# Altium schematic sheet SMPS_sync_rect.SchDoc
size A3; Organization: Altium Limited; Address1: L3, 12a Rodborough Rd; Address2: Frenchs Forest; Address3: NSW; Address4: Australia 2086
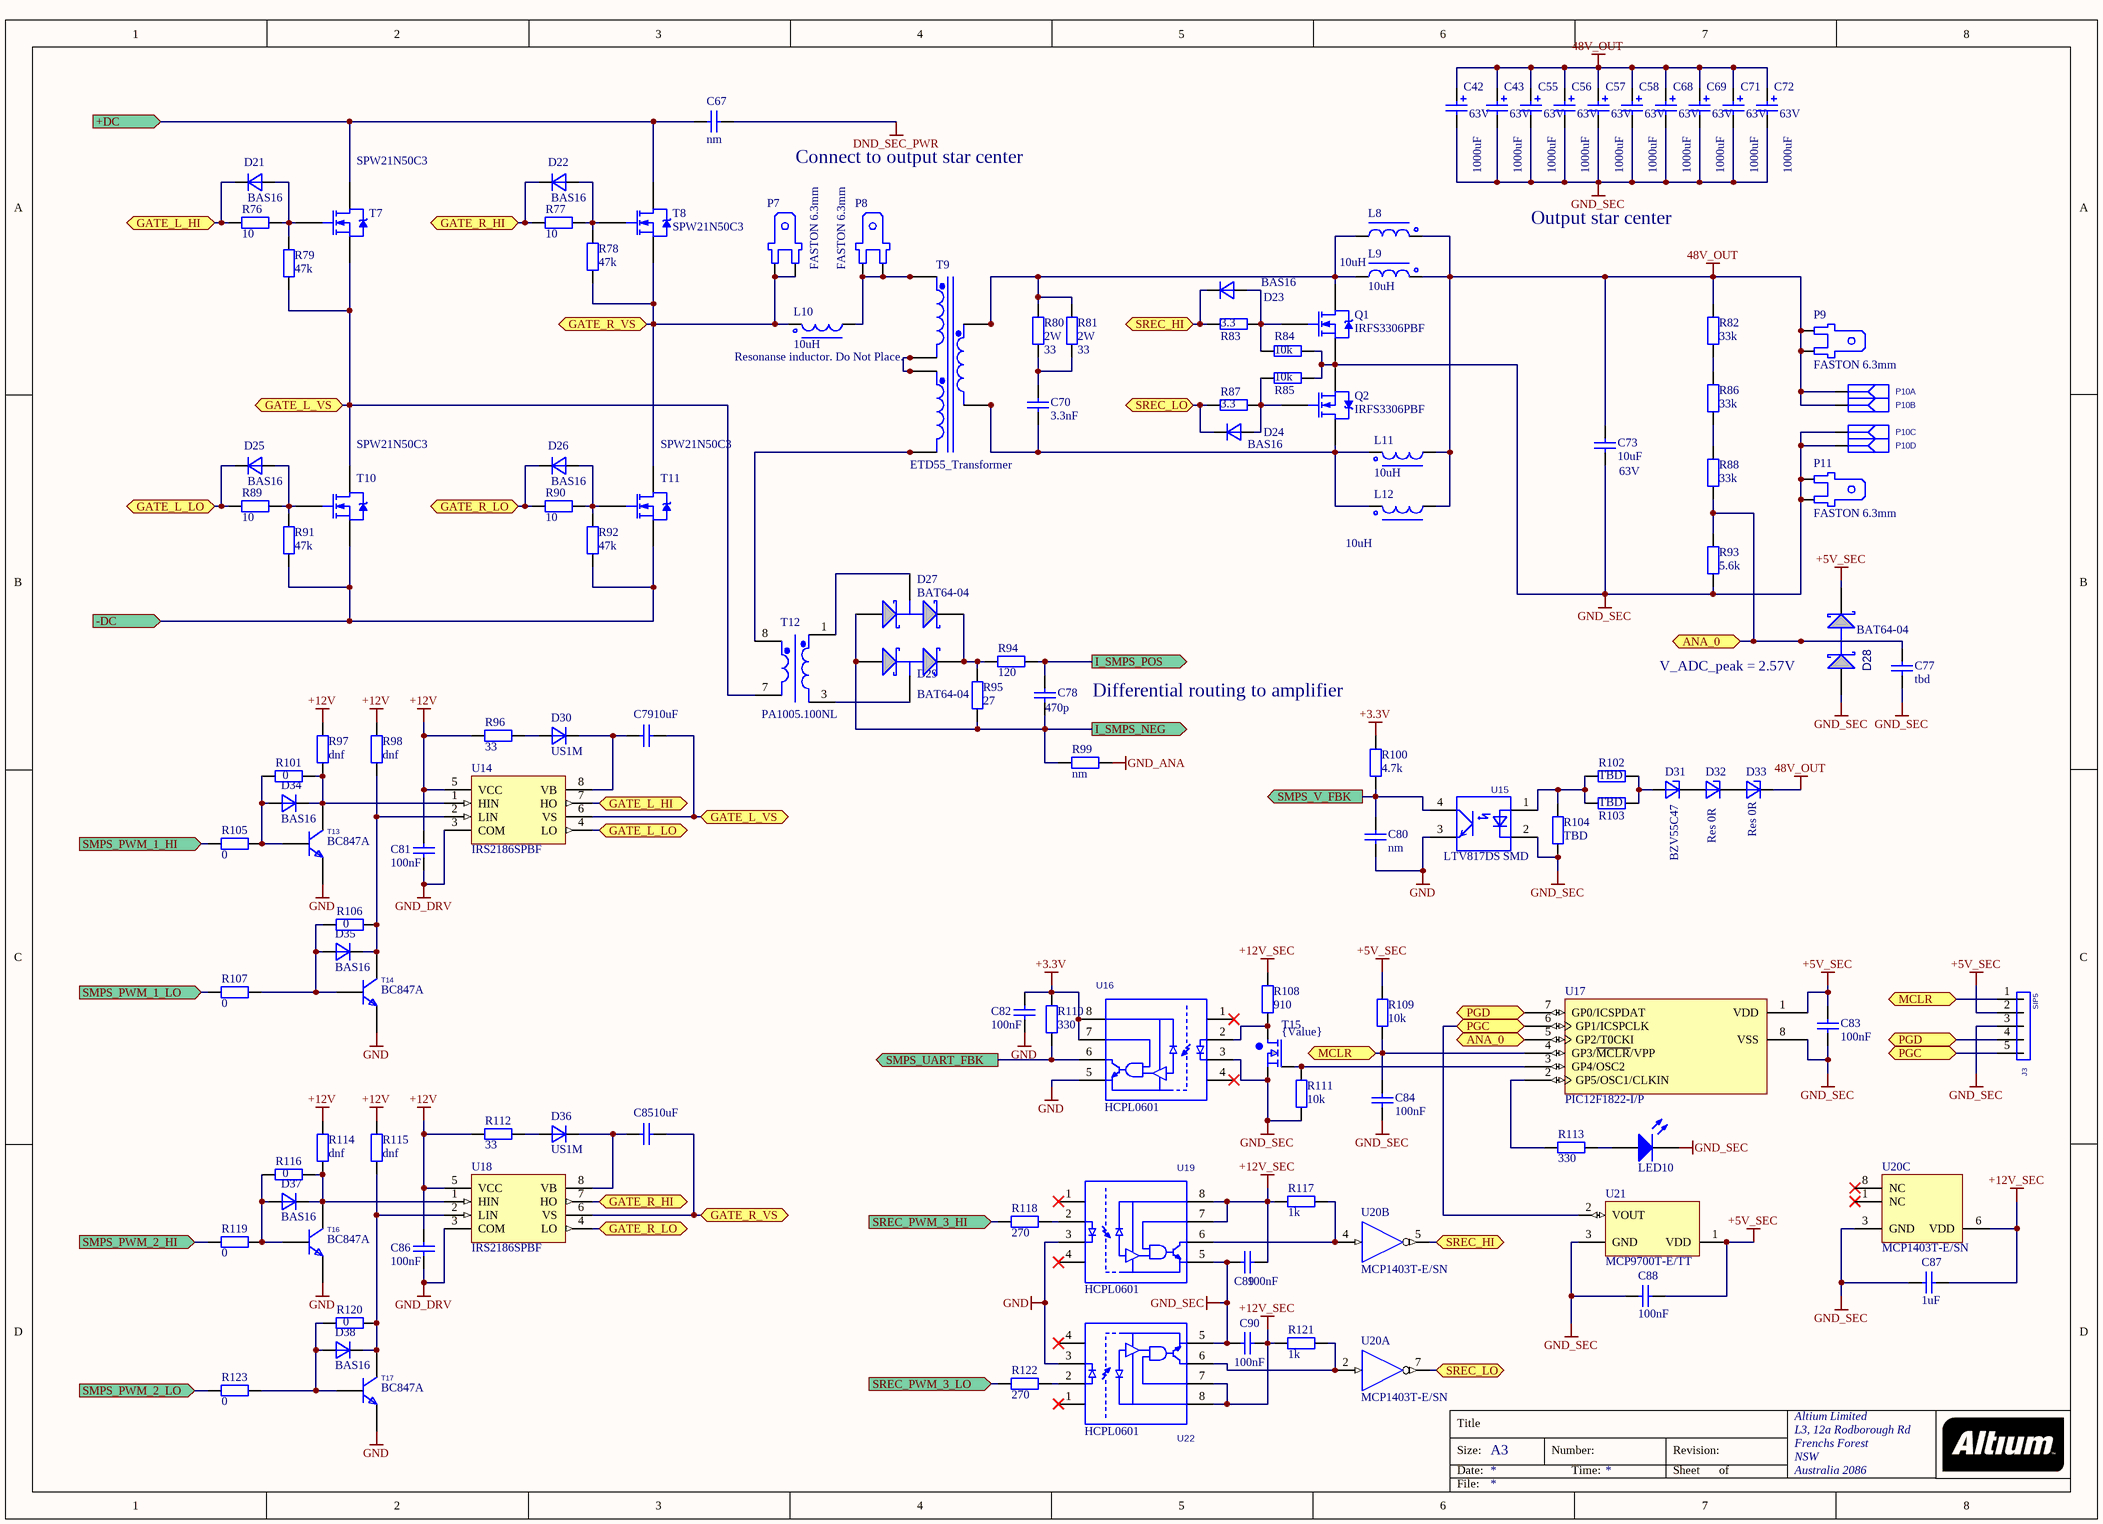
[diagram p0: SMPS_sync_rect.SchDoc]

## Parts
C42  value 1000uF  Voltage: 63V  [CAPPR7.5-18x35.5]  (hidden comment: Cap)
C43  value 1000uF  Voltage: 63V  [CAPPR7.5-18x35.5]  (hidden comment: Cap)
C55  value 1000uF  Voltage: 63V  [CAPPR7.5-18x35.5]  (hidden comment: Cap)
C56  value 1000uF  Voltage: 63V  [CAPPR7.5-18x35.5]  (hidden comment: Cap)
C57  value 1000uF  Voltage: 63V  [CAPPR7.5-18x35.5]  (hidden comment: Cap)
C58  value 1000uF  Voltage: 63V  [CAPPR7.5-18x35.5]  (hidden comment: Cap)
C67  value nm  [CAP26X19P22_5H]  (hidden comment: Cap)
C68  value 1000uF  Voltage: 63V  [CAPPR7.5-18x35.5]  (hidden comment: Cap)
C69  value 1000uF  Voltage: 63V  [CAPPR7.5-18x35.5]  (hidden comment: Cap)
C70  value 3.3nF  [CAP26X19P22_5H]  (hidden comment: Cap)
C71  value 1000uF  Voltage: 63V  [CAPPR7.5-18x35.5]  (hidden comment: Cap)
C72  value 1000uF  Voltage: 63V  [CAPPR7.5-18x35.5]  (hidden comment: Cap)
C73  value 10uF  Voltage: 63V  [RECT 26.5X8.5 RM22.5]  (hidden comment: Cap)
C77  value tbd  [1206_REFLOW]  (hidden comment: Cap 1206)
C78  value 470p  [1206_REFLOW]  (hidden comment: Cap 1206)
C79  value 10uF  [1206_REFLOW]  (hidden comment: Cap 1206)
C80  value nm  [1206_REFLOW]  (hidden comment: Cap 1206)
C81  value 100nF  [1206_REFLOW]  (hidden comment: Cap 1206)
C82  value 100nF  [1206_REFLOW]  (hidden comment: Cap 1206)
C83  value 100nF  [1206_REFLOW]  (hidden comment: Cap 1206)
C84  value 100nF  [1206_REFLOW]  (hidden comment: Cap 1206)
C85  value 10uF  [1206_REFLOW]  (hidden comment: Cap 1206)
C86  value 100nF  [1206_REFLOW]  (hidden comment: Cap 1206)
C87  value 1uF  [1206_REFLOW]  (hidden comment: Cap 1206)
C88  value 100nF  [1206_REFLOW]  (hidden comment: Cap 1206)
C89  value 100nF  [1206_REFLOW]  (hidden comment: Cap 1206)
C90  value 100nF  [1206_REFLOW]  (hidden comment: Cap 1206)
D21  BAS16  [SOT23_HIS_Primary]
D22  BAS16  [SOT23_HIS_Primary]
D23  BAS16  [SOT23_HIS_Primary]
D24  BAS16  [SOT23_HIS_Primary]
D25  BAS16  [SOT23_HIS_Primary]
D26  BAS16  [SOT23_HIS_Primary]
D27  BAT64-04  [SOT23_HIS_Primary]
D28  BAT64-04  [SOT23_HIS_Primary]
D29  BAT64-04  [SOT23_HIS_Primary]
D30  US1M  [DO-214_S1A(Primary)]
D31  value BZV55C47  [D_MINIMELF_BZV55C5V1(Primary)]  (hidden comment: BZV55CXXX)
D32  value Res 0R  [D_MINIMELF_BZV55C5V1(Primary)]  (hidden comment: BZV55CXXX)
D33  value Res 0R  [D_MINIMELF_BZV55C5V1(Primary)]  (hidden comment: BZV55CXXX)
D34  BAS16  [SOT23_HIS_Primary]
D35  BAS16  [SOT23_HIS_Primary]
D36  US1M  [DO-214_S1A(Primary)]
D37  BAS16  [SOT23_HIS_Primary]
D38  BAS16  [SOT23_HIS_Primary]
J3  SIP5  [SIP5 _2]
L8  value 10uH  [VISHAY DALE - IHLP6767GZER100M01]  (hidden comment: SRP1270-100M)
L9  value 10uH  [BOURNS - SRP1270-100M]  (hidden comment: SRP1270-100M)
L10  Resonanse inductor. Do Not Place.  value 10uH  [BOURNS - SRP1270-100M]
L11  value 10uH  [BOURNS - SRP1270-100M]  (hidden comment: SRP1270-100M)
L12  value 10uH  [VISHAY DALE - IHLP6767GZER100M01]  (hidden comment: SRP1270-100M)
LED10  LED  [LED_1206]  (value not drawn)
P7  FASTON 6.3MM  [FASTON 6.3mm]
P8  FASTON 6.3MM  [FASTON 6.3mm]
P9  FASTON 6.3MM  [FASTON 6.3mm]
P10  MSTBA 2,5/ 4-G-5,08  [MSTBA2.5/4G-5.08]  (value not drawn)  (parts A,B,C,D of 4)
P11  FASTON 6.3MM  [FASTON 6.3mm]
Q1  IRFS3306PBF  [D2PAK]
Q2  IRFS3306PBF  [D2PAK]
R76  value 10  [1206_REFLOW]  (hidden comment: RES)
R77  value 10  [1206_REFLOW]  (hidden comment: RES)
R78  value 47k  [1206_REFLOW]  (hidden comment: RES)
R79  value 47k  [1206_REFLOW]  (hidden comment: RES)
R80  2W  value 33  [5.5x16mm (2W BODY RES)]
R81  2W  value 33  [5.5x16mm (2W BODY RES)]
R82  value 33k  [1206_REFLOW]  (hidden comment: RES)
R83  value 3.3  [1206_REFLOW]  (hidden comment: RES)
R84  value 10k  [1206_REFLOW]  (hidden comment: RES)
R85  value 10k  [1206_REFLOW]  (hidden comment: RES)
R86  value 33k  [1206_REFLOW]  (hidden comment: RES)
R87  value 3.3  [1206_REFLOW]  (hidden comment: RES)
R88  value 33k  [1206_REFLOW]  (hidden comment: RES)
R89  value 10  [1206_REFLOW]  (hidden comment: RES)
R90  value 10  [1206_REFLOW]  (hidden comment: RES)
R91  value 47k  [1206_REFLOW]  (hidden comment: RES)
R92  value 47k  [1206_REFLOW]  (hidden comment: RES)
R93  value 5.6k  [1206_REFLOW]  (hidden comment: RES)
R94  value 120  [1206_REFLOW]  (hidden comment: RES)
R95  value 27  [1206_REFLOW]  (hidden comment: RES)
R96  value 33  [1206_REFLOW]  (hidden comment: RES)
R97  value dnf  [1206_REFLOW]  (hidden comment: RES)
R98  value dnf  [1206_REFLOW]  (hidden comment: RES)
R99  value nm  [1206_REFLOW]  (hidden comment: RES)
R100  value 4.7k  [1206_REFLOW]  (hidden comment: RES)
R101  value 0  [1206_REFLOW]  (hidden comment: RES)
R102  value TBD  [1206_REFLOW]  (hidden comment: RES)
R103  value TBD  [1206_REFLOW]  (hidden comment: RES)
R104  value TBD  [1206_REFLOW]  (hidden comment: RES)
R105  value 0  [1206_REFLOW]  (hidden comment: RES)
R106  value 0  [1206_REFLOW]  (hidden comment: RES)
R107  value 0  [1206_REFLOW]  (hidden comment: RES)
R108  value 910  [1206_REFLOW]  (hidden comment: RES)
R109  value 10k  [1206_REFLOW]  (hidden comment: RES)
R110  value 330  [1206_REFLOW]  (hidden comment: RES)
R111  value 10k  [1206_REFLOW]  (hidden comment: RES)
R112  value 33  [1206_REFLOW]  (hidden comment: RES)
R113  value 330  [1206_REFLOW]  (hidden comment: RES)
R114  value dnf  [1206_REFLOW]  (hidden comment: RES)
R115  value dnf  [1206_REFLOW]  (hidden comment: RES)
R116  value 0  [1206_REFLOW]  (hidden comment: RES)
R117  value 1k  [1206_REFLOW]  (hidden comment: RES)
R118  value 270  [1206_REFLOW]  (hidden comment: RES)
R119  value 0  [1206_REFLOW]  (hidden comment: RES)
R120  value 0  [1206_REFLOW]  (hidden comment: RES)
R121  value 1k  [1206_REFLOW]  (hidden comment: RES)
R122  value 270  [1206_REFLOW]  (hidden comment: RES)
R123  value 0  [1206_REFLOW]  (hidden comment: RES)
T7  value SPW21N50C3  [TO-247HV]  (hidden comment: MOSFET, N, 500V, TO-247)
T8  value SPW21N50C3  [TO-247HV]  (hidden comment: MOSFET, N, 500V, TO-247)
T9  ETD55_Transformer  [ETD54_Transformer]
T10  value SPW21N50C3  [TO-247HV]  (hidden comment: MOSFET, N, 500V, TO-247)
T11  value SPW21N50C3  [TO-247HV]  (hidden comment: MOSFET, N, 500V, TO-247)
T12  value PA1005.100NL  [PA1005.XXXNL Series]  (hidden comment: PA1005.XXXNL)
T13  BC847A  [SOT23_HIS_Primary]
T14  BC847A  [SOT23_HIS_Primary]
T15  value {Value}  [SOT23_HIS_Primary]  (hidden comment: MOSFET N SOT23)
T16  BC847A  [SOT23_HIS_Primary]
T17  BC847A  [SOT23_HIS_Primary]
U14  IRS2186SPBF  [SO-8_N]
U15  LTV817DS SMD  [DIP4 SMD]
U16  HCPL0601  [SO8_HIS]
U17  PIC12F1822-I/P  [PDIP300-P8]
U18  IRS2186SPBF  [SO-8_N]
U19  HCPL0601  [SO8_HIS]
U20  MCP1403T-E/SN  [SOIC-SN8_N]  (parts A,B,C of 3)
U21  MCP9700T-E/TT  [SOT-23-TT3_N]
U22  HCPL0601  [SO8_HIS]

## Ports
+DC (in), -DC (in), ANA_0, GATE_L_HI (bidir), GATE_L_LO (bidir), GATE_L_VS (bidir), GATE_R_HI (bidir), GATE_R_LO (bidir), GATE_R_VS (bidir), I_SMPS_NEG (out), I_SMPS_POS (out), MCLR, PGC (bidir), PGD, SMPS_PWM_1_HI (in), SMPS_PWM_1_LO (in), SMPS_PWM_2_HI (in), SMPS_PWM_2_LO (in), SMPS_UART_FBK (out), SMPS_V_FBK (out), SREC_HI (bidir), SREC_LO (bidir), SREC_PWM_3_HI (in), SREC_PWM_3_LO (in)

## Nets
48V_OUT: C42.1 C43.1 C55.1 C56.1 C57.1 C58.1 C68.1 C69.1 C71.1 C72.1 C73.2 D33.K L8.2 L9.2 L11.1 L12.1 P9.1 P9.2 P10.1(SIG) P10.2(SIG) R82.1
+3.3V: C82.1 R100.1 R110.1 U16.7(Ve) U16.8(Vcc)
+5V_SEC: C83.2 C88.1 D28.2(K) J3.2 R109.2 U17.1(VDD) U21.1(VDD)
+12V: C81.1 C86.1 R96.1 R97.1 R98.1 R112.1 R114.1 R115.1 U14.5(VCC) U18.5(VCC)
+12V_SEC: C87.1 C89.1 C90.1 R108.2 R117.1 R121.1 U19.7(Ve) U19.8(Vcc) U20.6(VDD) U22.7(Ve) U22.8(Vcc)
DND_SEC_PWR: C67.1
GND: C80.1 C82.2 T13.2(E) T14.2(E) T16.2(E) T17.2(E) U15.3(C) U16.5(GND) U19.3(Vf-) U22.3(Vf-)
GND_ANA: R99.2
GND_DRV: C81.2 C86.2 U14.3(COM) U18.3(COM)
GND_SEC: C42.2 C43.2 C55.2 C56.2 C57.2 C58.2 C68.2 C69.2 C71.2 C72.2 C73.1 C77.1 C83.1 C84.1 C87.2 C88.2 C89.2 C90.2 D28.1(A) J3.3 LED10.K P10.3(SIG) P10.4(SIG) P11.1 P11.2 Q1.3(S) Q2.3(S) R84.2 R85.2 R93.2 R104.1 R111.1 T15.2(S) U15.2(K) U16.3(Vf-) U17.8(VSS) U19.5(GND) U20.3(GND) U21.3(GND) U22.5(GND)
+DC: C67.2 T7.2(D) T8.2(D) ; port +DC
-DC: R91.2 R92.1 T10.3(S) T11.3(S) ; port -DC
ANA_0: C77.2 D28.3(C) R88.2 R93.1 U17.5(GP2/T0CKI) ; port ANA_0
GATE_L_HI: D21.3(K) R76.1 U14.7(HO) ; port GATE_L_HI
GATE_L_LO: D25.3(K) R89.2 U14.4(LO) ; port GATE_L_LO
GATE_L_VS: C79.1 R79.1 T7.3(S) T10.2(D) T12.7(Pri-) U14.6(VS) ; port GATE_L_VS
GATE_R_HI: D22.3(K) R77.2 U18.7(HO) ; port GATE_R_HI
GATE_R_LO: D26.3(K) R90.1 U18.4(LO) ; port GATE_R_LO
GATE_R_VS: C85.1 L10.2 P7.1 P7.2 R78.2 T8.3(S) T11.2(D) U18.6(VS) ; port GATE_R_VS
I_SMPS_NEG: C78.1 D27.1(A) D29.1(A) R95.2 R99.1 ; port I_SMPS_NEG
I_SMPS_POS: C78.2 R94.2 ; port I_SMPS_POS
MCLR: C84.2 J3.1 R109.1 U17.4(GP3/~{MCLR}/VPP) ; port MCLR
PGC: J3.5 U17.6(GP1/ICSPCLK) U21.2(VOUT) ; port PGC
PGD: J3.4 U17.7(GP0/ICSPDAT) ; port PGD
SMPS_PWM_1_HI: R105.1 ; port SMPS_PWM_1_HI
SMPS_PWM_1_LO: R107.1 ; port SMPS_PWM_1_LO
SMPS_PWM_2_HI: R119.1 ; port SMPS_PWM_2_HI
SMPS_PWM_2_LO: R123.1 ; port SMPS_PWM_2_LO
SMPS_UART_FBK: R110.2 U16.6(Vo) ; port SMPS_UART_FBK
SMPS_V_FBK: C80.2 R100.2 U15.4(E) ; port SMPS_V_FBK
SREC_HI: D23.3(K) R83.2 U20.5(~{OUTB}) ; port SREC_HI
SREC_LO: D24.3(K) R87.2 U20.7(~{OUTA}) ; port SREC_LO
SREC_PWM_3_HI: R118.1 ; port SREC_PWM_3_HI
SREC_PWM_3_LO: R122.1 ; port SREC_PWM_3_LO
NetC70_1: C70.1 R80.1 R81.1
NetC70_2: C70.2 L11.2 L12.2 Q2.2(D) T9.12(Sec2+) T9.13(Sec2+) T9.14(Sec2+) T9.15(Sec2+)
NetC79_2: C79.2 D30.K U14.8(VB)
NetC85_2: C85.2 D36.K U18.8(VB)
NetD21_1: D21.1(A) R76.2 R79.2 T7.1(G)
NetD22_1: D22.1(A) R77.1 R78.1 T8.1(G)
NetD23_1: D23.1(A) Q1.1(G) R83.1 R84.1
NetD24_1: D24.1(A) Q2.1(G) R85.1 R87.1
NetD25_1: D25.1(A) R89.1 R91.1 T10.1(G)
NetD26_1: D26.1(A) R90.2 R92.2 T11.1(G)
NetD27_2: D27.2(K) D29.2(K) R94.1 R95.1
NetD27_3: D27.3(C) T12.3(Sec2+)
NetD29_3: D29.3(C) T12.1(Sec1+)
NetD30_A: D30.A R96.2
NetD31_A: D31.A R102.2 R103.2
NetD31_K: D31.K D32.A
NetD32_K: D32.K D33.A
NetD34_1: D34.1(A) R101.1 R105.2 T13.1(B)
NetD34_3: D34.3(K) R97.2 R101.2 T13.3(C) U14.1(HIN)
NetD35_1: D35.1(A) R106.1 R107.2 T14.1(B)
NetD35_3: D35.3(K) R98.2 R106.2 T14.3(C) U14.2(LIN)
NetD36_A: D36.A R112.2
NetD37_1: D37.1(A) R116.1 R119.2 T16.1(B)
NetD37_3: D37.3(K) R114.2 R116.2 T16.3(C) U18.1(HIN)
NetD38_1: D38.1(A) R120.1 R123.2 T17.1(B)
NetD38_3: D38.3(K) R115.2 R120.2 T17.3(C) U18.2(LIN)
NetL8_1: L8.1 L9.1 Q1.2(D) R80.2 R81.2 T9.19(Sec2+) T9.20(Sec2+) T9.21(Sec1+) T9.22(Sec1+)
NetL10_1: L10.1 P8.1 P8.2 T9.1(Pri+) T9.2(Pri+)
NetLED10_A: LED10.A R113.2
NetR82_2: R82.2 R86.1
NetR86_2: R86.2 R88.1
NetR102_1: R102.1 R103.1 R104.2 U15.1(A)
NetR108_1: R108.1 T15.3(D) U16.2(Vf+)
NetR111_2: R111.2 T15.1(G) U17.3(GP4/OSC2)
NetR113_1: R113.1 U17.2(GP5/OSC1/CLKIN)
NetR117_2: R117.2 U19.6(Vo) U20.4(INB)
NetR118_2: R118.2 U19.2(Vf+)
NetR121_2: R121.2 U20.2(INA) U22.6(Vo)
NetR122_2: R122.2 U22.2(Vf+)
NetT9_3: T9.3(Pri-) T9.4(Pri+) T9.8(Pri+) T9.9(Pri+)
NetT9_10: T9.10(Pri-) T9.11(Pri+) T12.8(Pri+)

Not connected (* = marked no-connect by the designer): D21 2(NC); D22 2(NC); D23 2(NC); D24 2(NC); D25 2(NC); D26 2(NC); D34 2(NC); D35 2(NC); D37 2(NC); D38 2(NC); U16 1(N/C)* 4(N/C)*; U19 1(N/C)* 4(N/C)*; U20 1(NC)* 8(NC)*; U22 1(N/C)* 4(N/C)*

## Notes on the sheet
- Connect to output star center
- Output star center
- Differential routing to amplifier
- (near D28) V_ADC_peak = 2.57V
- Title
- Size:
- Date:
- A3
- Number:
- Time:
- Revision:
- Sheet
- of
- File:

## Library data of the parts
C42 C43 C55-C58 C68 C69 C71 C72 = Cap pol: Manufacturer: *; Manufacturer Order Code: *; Supplier Order Code: *
C73 = Cap: Manufacturer: WIMA; Manufacturer Order Code: MKS4C051005F00KSSD; Supplier Order Code: CW 10uF 63V 10% MKS4
D21-D26 D34 D35 D37 D38 = BAS16: DIODE, SINGLE SOT-23; Manufacturer: Any; Group: Discrete; Subgroup1: Small Signal; Order Code: BAS16 SMD (SOT23); Subgroup: Diode; Package: SOT23; Mounting: SMD; Supplier: Comet; Value: BAS16
D27-D29 = BAT64-04: Silicon Schottky Diodes; Manufacturer: INF; ComponentLink1DescBC: Manufacturer Link; Group: Discrete; Subgroup: Diode; Published: 21-Mar-2003; DatasheetDocument: Oct-1999; PackageDocument: Sep-2001; PackageReference: SOT-23; Publisher: Altium Limited; ComponentLink1URL: http://www.infineon.com/; Value: BAT64-04
D30 D36 = S1A: Value: US1M
D31-D33 = BZV55CXXX: Zener Diode
L8 L12 = IHLP6767GZERxxxM01: VISHAY DALE - IHLP6767GZER100M01 - INDUCTOR, 10UH, 25A, 20%; Order Code: 1741419; Rated Current: 25A; Manufacturer: VISHAY DALE; Manufacturer Order Code: IHLP6767GZER100M01
L9-L11 = BOURNS - SRP1270-xxxM: BOURNS - SRP1270-100M - INDUCTOR, SMD, 10UH, 16A; Order Code: 1828128; Rated Current: 16A; Manufacturer: Bourns; Manufacturer Order Code: SRP1270-100M
LED10 = LED: Value: TBD
P10 = MSTBA 2,5/ 4-G-5,08: Header, right angled, 12 A, 250 V, pitch 5.08 mm, No. of poles:4; Manufacturer: Phoenix; Mfrr. Part No.: 1757268; Group: Connector; Subgroup: Industrial; Value: MSTBA2,5/4; Mounting: TH; Supplier: Any; Order Code: *
Q1 Q2 = IRF840AS: HEXFET Power MOSFET; Published: 17-Sep-2003; DatasheetVersion: 16-Dec-1999; PackageReference: D2PAK; Publisher: Altium Limited; PackageDescription: D2-PAK/TO-263-AB; 3 Leads (1 Cropped); Body 15.5 (inc. leads) x 10.5 mm (LxW max); ComponentLink1Description: Manufacturer Link; ComponentLink1URL: http://www.irf.com/; ComponentLink2Description: Datasheet; ComponentLink2URL: http://www.irf.com/product-info/datasheets/data/IRLP3803.pdf
R76-R81 R83-R85 R87 R89-R92 R94-R123 = RES 1
  R94-R96 R99 R100 R102-R104 R112 R113: Tolerance: *
R82 R86 R88 R93 = RES 1: Tolerance: 1%
T7 T8 T10 T11 = SPW21N50C3: INFINEON - SPW21N50C3 - MOSFET, N, 500V, TO-247; Farnell Order Code: 1471815
T9 = ETD55_Transformer: Core Manufacturer: Kashke; Primary Voltage: 400V; Secondary Voltage: 2x24V; Core Material Type: EPCOS; Core Geometry: ETD54; Primary Turns: *; Secondary Turns: *; Primary Wire Size: *; Secondary Wire Size: *
T12 = PA1005.XXXNL Series: Manufacturer: PULSE ELECTRONICS CORPORATION; Current Rating: 20A; Turns Ratio - Primary:Secondary: *; Inductance: *; DC Resistance (DCR): *
T13 T14 T16 T17 = BC847A: NPN General Purpose Amplifier; OriginalName: BC847ALT1; ComponentField7: Published 29-Sep-2000; Group: Discrete; Subgroup: Transistor; Subgroup1: NPN General Purpose; Package: SOT23; Mounting: SMD; Value: BC847A
U14 U18 = IRS2186SPBF: Half-Bridge Driver; Published: 8-Jun-2000; LatestRevisionDate: 13-Apr-2006; LatestRevisionNote: IPC-7351 Footprint Added.; DatasheetVersion: PD60028J; PackageVersion: Feb-2001; PackageReference: SO-8; Publisher: Altium Limited; PackageDescription: 8-Pin Plastic Small Outline Integrated Circuit 1.27 mm Pitch; Code_JEDEC: MS-012-AA; Code_IPC: SOIC127P600-8; ComponentLink1Description: Manufacturer Link; ComponentLink1URL: http://www.irf.com/; ComponentLink2Description: Datasheet
U15 = LTV817DS SMD: Manufacturer 1: LITEON; PN: 01010211-xxxx-xxxx; Group: Optocouplers; Detail: CTR 300-600% 35V 5kV 4/3uS; Case: DIP4 SMD; Mfr 1 PN: LTV817DS; Supplier 1: Comet; Order Code 1: LTV817DS SMD; Price 1: 0.063ˆ; Value: LTV817DS SMD
U17 = PIC12F508-I/P: 8-bit Flash Microcontroller, 512 (x12-Bit words) Program Memory, 25 Bytes Data Memory, 8-Pin PDIP, Industrial Temperature; Published: 29-Jan-2009; DatasheetVersion: revD, Dec-2007; PackageVersion: revAW, Oct-2008; PackageReference: PDIP300-P8; Publisher: Altium Limited; PackageDescription: 8-Lead Plastic Dual In-Line (P) - 300 mil Body [PDIP]; Code_JEDEC: MS-001; ComponentLink1Description: Manufacturer Link; ComponentLink1URL: http://www.microchip.com; ComponentLink2Description: Datasheet; ComponentLink2URL: http://ww1.microchip.com/downloads/en/DeviceDoc/41236D.pdf; ComponentLink3Description: Packaging Specification; ComponentLink3URL: http://ww1.microchip.com/downloads/en/PackagingSpec/00049AW.pdf
U20 = MCP1403T-E/SN: 4.5A Dual High-Speed Power MOSFET Drivers, Inverting, Extended Temperature, Tape and Reel; Published: 29-Jan-2009; DatasheetVersion: revB, May-2007; PackageVersion: revAW, Oct-2008; PackageReference: SOIC-SN8; Publisher: Altium Limited; PackageDescription: 8-Lead Plastic Small Outline (SN) - Narrow, 3.90mm Body [SOIC]; Code_JEDEC: MS-012; Code_IPC: SOIC127P600-8; ComponentLink1Description: Manufacturer Link; ComponentLink1URL: http://www.microchip.com; ComponentLink2Description: Datasheet; ComponentLink2URL: http://ww1.microchip.com/downloads/en/DeviceDoc/22022b.pdf; ComponentLink3Description: Packaging Specification; ComponentLink3URL: http://ww1.microchip.com/downloads/en/PackagingSpec/00049AW.pdf
U21 = MCP9700T-E/TT: Low-Power Linear Active Thermistor IC, 3-Pin SOT-23, Extended Temperature, Tape and Reel; Published: 29-Jan-2009; DatasheetVersion: revD, Oct-2007; PackageVersion: revAW, Oct-2008; PackageReference: SOT-23-TT3; Publisher: Altium Limited; Code_IPC: SOT23-3; ComponentLink1Description: Manufacturer Link; ComponentLink1URL: http://www.microchip.com; ComponentLink2Description: Datasheet; ComponentLink2URL: http://ww1.microchip.com/downloads/en/DeviceDoc/21942d.pdf; ComponentLink3Description: Packaging Specification; ComponentLink3URL: http://ww1.microchip.com/downloads/en/PackagingSpec/00049AW.pdf
C67 C70 = Cap: Voltage: *; Manufacturer: *; Order Code: *
C77-C90 = Cap 1206
  C78-C81 C85 C86: Supplier: *; Supplier Order Code: *; Manufacturer: *; Manufacturer Order Code: *; Voltage: *; Tolerance: *; Series: *
J3 = SIP5: Value: *
P7-P9 P11 = FASTON 6.3MM: Value: FASTON 6.3mm
U16 U19 U22 = HCPL0601: Value: HCPL0601